# EAGLE design battery_sensor_connector (EAGLE 5.04)
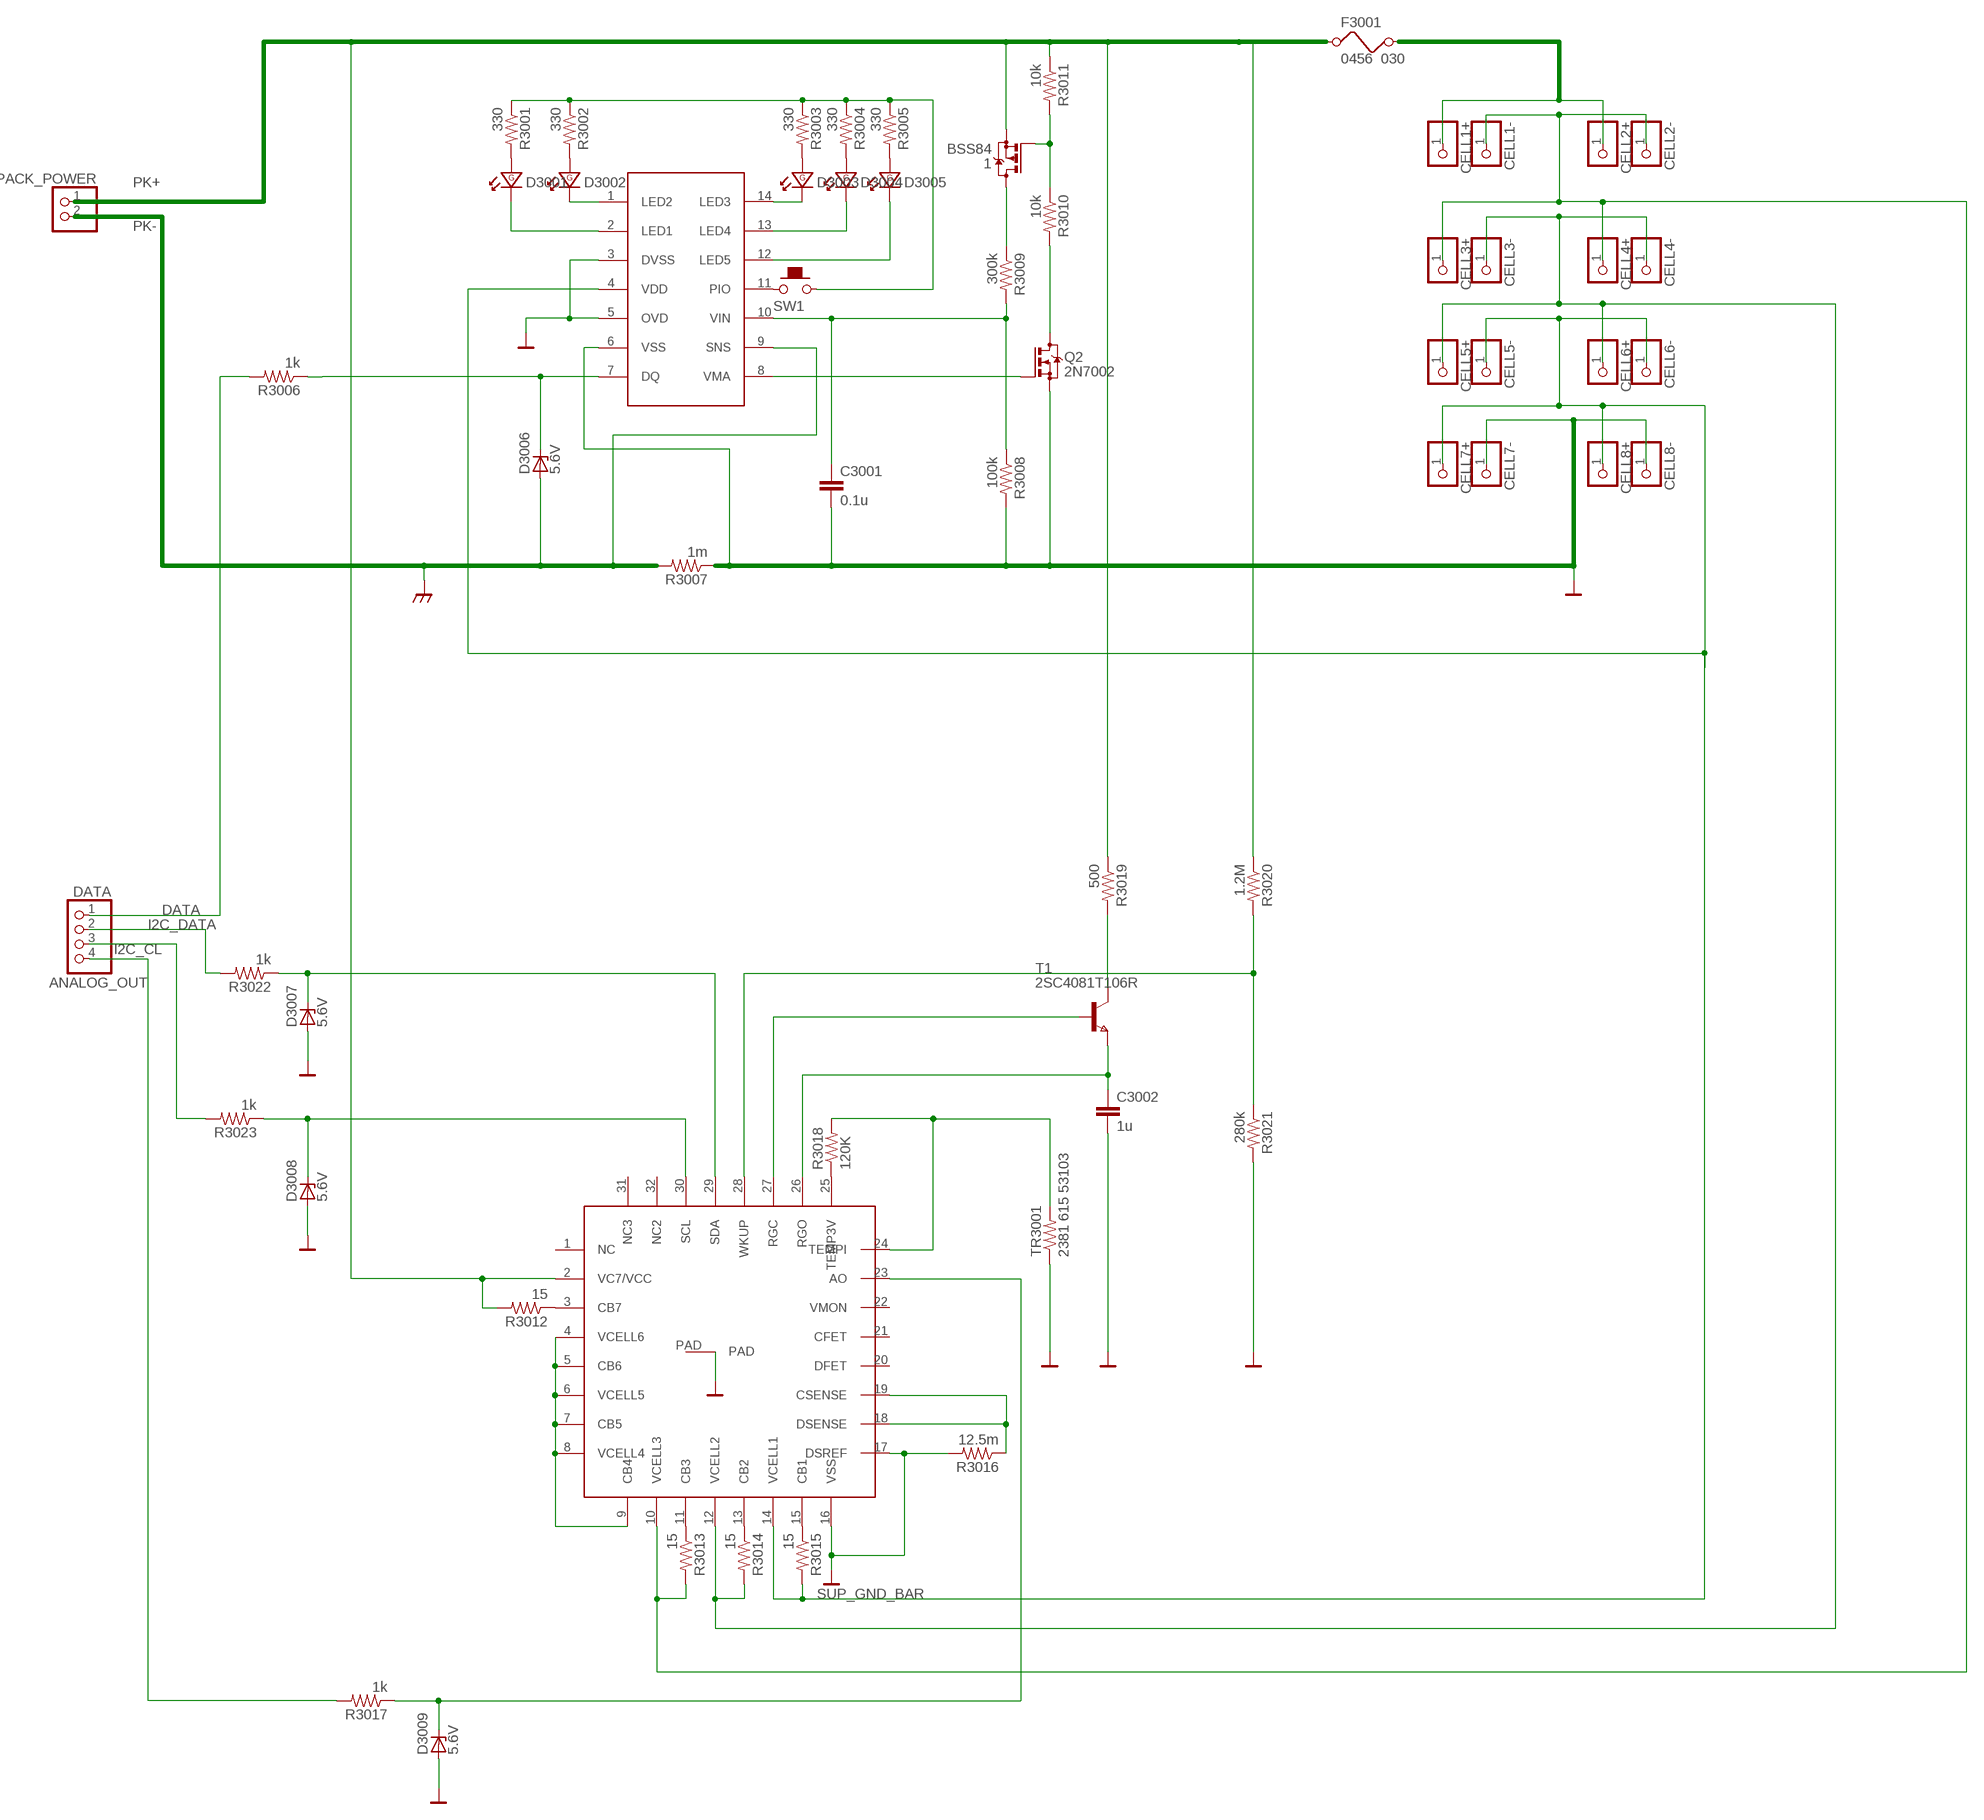
[diagram p0: schematic, sheet 1]

## Parts
1  BSS84  FET_P-CHNL  [SOT23-3]
C3001  0.1u  C-EUC0805  [C0805]
C3002  1u  C-EUC0805  [C0805]
CELL1+  PINHD-1X1  [1X01]
CELL1-  PINHD-1X1  [1X01]
CELL2+  PINHD-1X1  [1X01]
CELL2-  PINHD-1X1  [1X01]
CELL3+  PINHD-1X1  [1X01]
CELL3-  PINHD-1X1  [1X01]
CELL4+  PINHD-1X1  [1X01]
CELL4-  PINHD-1X1  [1X01]
CELL5+  PINHD-1X1  [1X01]
CELL5-  PINHD-1X1  [1X01]
CELL6+  PINHD-1X1  [1X01]
CELL6-  PINHD-1X1  [1X01]
CELL7+  PINHD-1X1  [1X01]
CELL7-  PINHD-1X1  [1X01]
CELL8+  PINHD-1X1  [1X01]
CELL8-  PINHD-1X1  [1X01]
D3001  LED-GRN-0805  [0805-DIODE]
D3002  LED-GRN-0805  [0805-DIODE]
D3003  LED-GRN-0805  [0805-DIODE]
D3004  LED-GRN-0805  [0805-DIODE]
D3005  LED-GRN-0805  [0805-DIODE]
D3006  5.6V  BZX84CSMD  [TO236]
D3007  5.6V  BZX84CSMD  [TO236]
D3008  5.6V  BZX84CSMD  [TO236]
D3009  5.6V  BZX84CSMD  [TO236]
DATA  PINHD-1X4  [1X04]
F3001  0456 030  FUSE1206  [1206]
PACK_POWER  PINHD-1X2  [1X02]
Q2  2N7002  FET_N-CHNLSOT223  [SOT223]
R3001  330  R-US_R0805  [R0805]
R3002  330  R-US_R0805  [R0805]
R3003  330  R-US_R0805  [R0805]
R3004  330  R-US_R0805  [R0805]
R3005  330  R-US_R0805  [R0805]
R3006  1k  R-US_R0805  [R0805]
R3007  1m  R-US_R0805  [R0805]
R3008  100k  R-US_R0805  [R0805]
R3009  300k  R-US_R0805  [R0805]
R3010  10k  R-US_R0805  [R0805]
R3011  10k  R-US_R0805  [R0805]
R3012  15  R-US_R0805  [R0805]
R3013  15  R-US_R0805  [R0805]
R3014  15  R-US_R0805  [R0805]
R3015  15  R-US_R0805  [R0805]
R3016  12.5m  R-US_R0805  [R0805]
R3017  1k  R-US_R0805  [R0805]
R3018  120K  R-US_R0805  [R0805]
R3019  500  R-US_R0805  [R0805]
R3020  1.2M  R-US_R0805  [R0805]
R3021  280k  R-US_R0805  [R0805]
R3022  1k  R-US_R0805  [R0805]
R3023  1k  R-US_R0805  [R0805]
SW1  SW_MOMENTARY-6X3.5MM  [SW_6X3.5MM]
T1  2SC4081T106R  NPNSOT323  [SOT323]
TR3001  2381 615 53103  R-US_R0805  [R0805]
U1  DS2788  [TSSOP14]
U2  ISL9208IRZ  [QFN32-5X5]

## Nets
ANALOG_OUT: DATA.4 R3017.2
BAR_GND: C3001.2 C3002.2 CELL7-.1 CELL8-.1 D3007.A D3008.A D3009.A Q2.3(S) R3007.1 R3008.2 R3016.2 R3021.2 TR3001.1 U1.3(DVSS) U1.5(OVD) U1.6(VSS) U2.16(U:VSS) U2.17(U:DSREF) ; supply symbol labelled SUP_GND_BAR
CELL4: CELL5-.1 CELL6-.1 CELL7+.1 CELL8+.1 R3015.2 U1.4(VDD) U2.14(U:VCELL1)
CELL_VOLTAGE: D3009.C R3017.1 U2.23(U:AO)
DATA: DATA.1 R3006.2
I2C_CL: D3008.C DATA.3 R3023.1 R3023.2 U2.30(U:SCL)
I2C_DATA: D3007.C DATA.2 R3022.1 R3022.2 U2.29(U:SDA)
N30: CELL1-.1 CELL2-.1 CELL3+.1 CELL4+.1 R3013.2 U2.10(U:VCELL3)
N$1: D3001.1(ANODE)(ANODE) R3001.2
N$3: D3002.1(ANODE)(ANODE) R3002.2
N$4: R3015.1 U2.15(U:CB1)
N$5: D3003.1(ANODE)(ANODE) R3003.2
N$7: R3014.1 U2.13(U:CB2)
N$8: D3004.1(ANODE)(ANODE) R3004.2
N$9: D3005.1(ANODE)(ANODE) R3005.2
N$11: D3002.2(CATHODE)(CATHODE) U1.1(LED2)
N$12: D3001.2(CATHODE)(CATHODE) U1.2(LED1)
N$13: D3003.2(CATHODE)(CATHODE) U1.14(LED3)
N$14: D3004.2(CATHODE)(CATHODE) U1.13(LED4)
N$15: D3005.2(CATHODE)(CATHODE) U1.12(LED5)
N$16: R3001.1 R3002.1 R3003.1 R3004.1 R3005.1 SW1.2
N$17: D3006.C R3006.1 U1.7(DQ)
N$18: C3002.1 T1.3(E) U2.26(U:RGO)
N$19: R3020.2 R3021.1 U2.28(U:WKUP)
N$20: C3001.1 R3008.1 R3009.2 U1.10(VIN)
N$21: Q2.1(G) U1.8(VMA)
N$22: 1.3(D) R3009.1
N$26: R3013.1 U2.11(U:CB3)
N$27: R3012.1 U2.3(U:CB7)
N$28: 1.1(G) R3010.1 R3011.2
N$29: CELL1+.1 CELL2+.1 F3001.2
N$30: U2.4(U:VCELL6) U2.5(U:CB6) U2.6(U:VCELL5) U2.7(U:CB5) U2.8(U:VCELL4) U2.9(U:CB4)
N$32: R3018.1 U2.25(U:TEMP3V)
N$33: R3018.2 TR3001.2 U2.24(U:TEMPI)
N$34: CELL3-.1 CELL4-.1 CELL5+.1 CELL6+.1 R3014.2 U2.12(U:VCELL2)
N$36: T1.2(B) U2.27(U:RGC)
N$39: R3019.2 T1.1(C)
N$40: SW1.1 U1.11(PIO)
N$41: Q2.4(D) R3010.2
N$43: R3016.1 U2.18(U:DSENSE) U2.19(U:CSENSE)
PK+: 1.2(S) F3001.1 PACK_POWER.1 R3011.1 R3012.2 R3019.1 R3020.1 U2.2(U:VC7/VCC)
PK-: D3006.A PACK_POWER.2 R3007.2 U1.9(SNS)
Unconnected: U2.1(U:NC) U2.20(U:DFET) U2.21(U:CFET) U2.22(U:VMON) U2.31(U:NC3) U2.32(U:NC2) U2.PAD(PAD:PAD)

## Library data of the parts
1 = psas_eagle_library:FET_P-CHNL: Generic P-Channel MOSFET
C3001 C3002 = rcl:C-EU: CAPACITOR, European symbol
CELL1+ CELL1- CELL2+ CELL2- CELL3+ CELL3- CELL4+ CELL4- CELL5+ CELL5- CELL6+ CELL6- CELL7+ CELL7- CELL8+ CELL8- = pinhead:PINHD-1X1: PIN HEADER
D3001-D3005 = psas_eagle_library:LED-GRN-?
D3006-D3009 = diode:BZX84CSMD: Z DIODE
DATA = pinhead:PINHD-1X4: PIN HEADER
F3001 = psas_eagle_library:FUSE: Fuse
PACK_POWER = pinhead:PINHD-1X2: PIN HEADER
Q2 = psas_eagle_library:FET_N-CHNL: Generic N-Channel MOSFET
R3001-R3023 TR3001 = rcl:R-US_: RESISTOR, American symbol
SW1 = psas_eagle_library-1.9:SW_MOMENTARY: Momentary push button
T1 = zetex:NPNSOT323: NPN TRANSISTOR
U1 = DS2788:DS2788: MAXIM stand-alone Fuel-Gauge IC with LED Display Drivers Package: 14 TSSOP
U2 = ISL9208:ISL9208: ISL9208 with Li-Ion Battery Pack analog front end

## Board
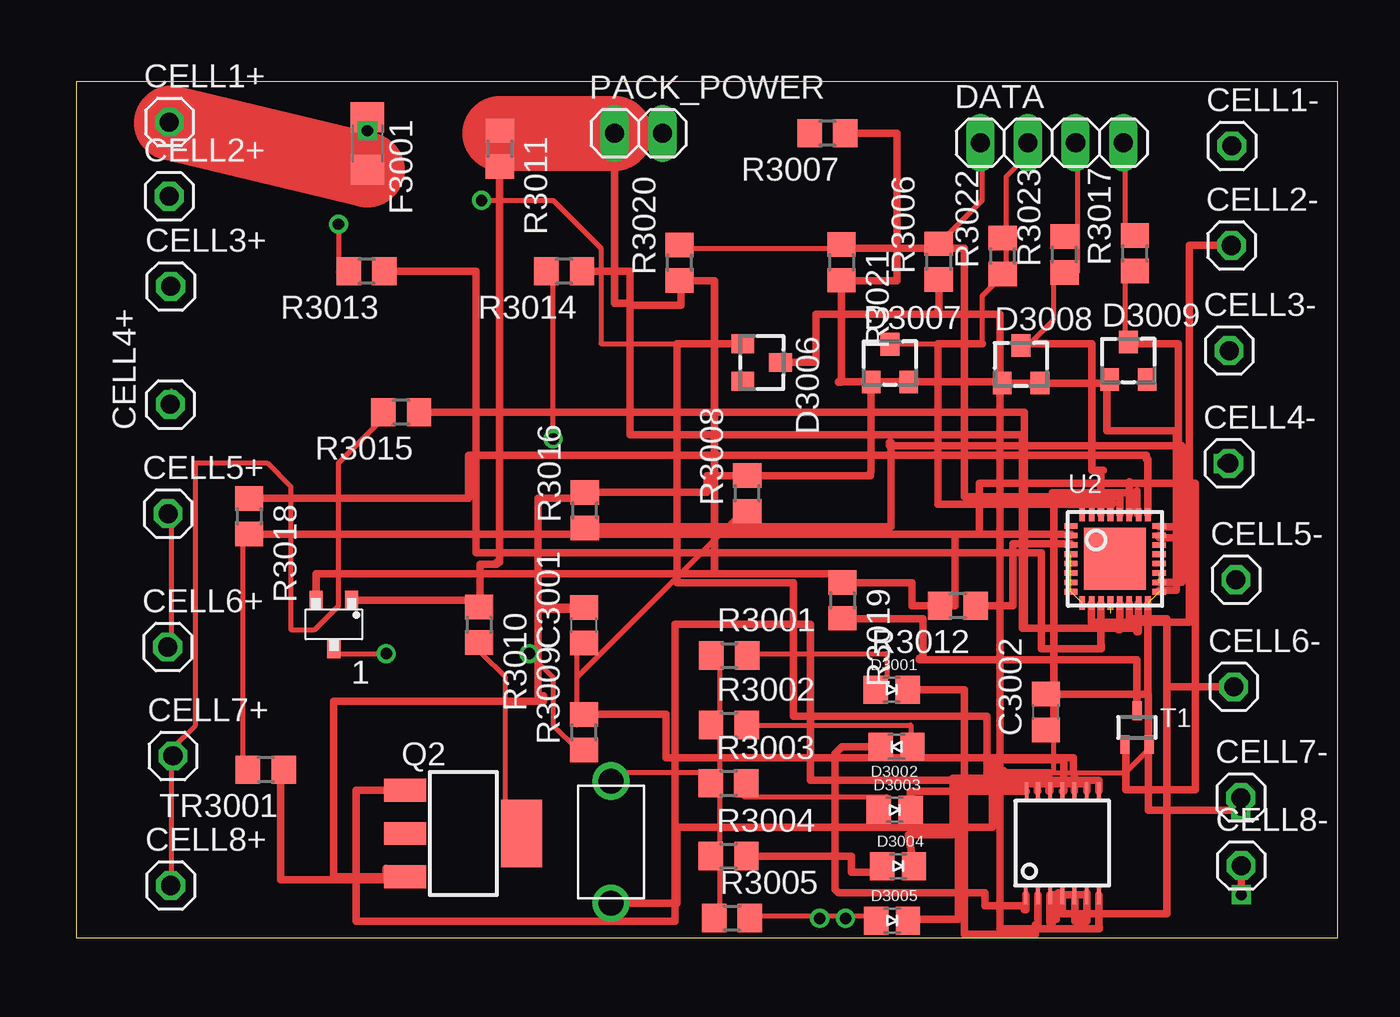
[diagram p1: board, top side]
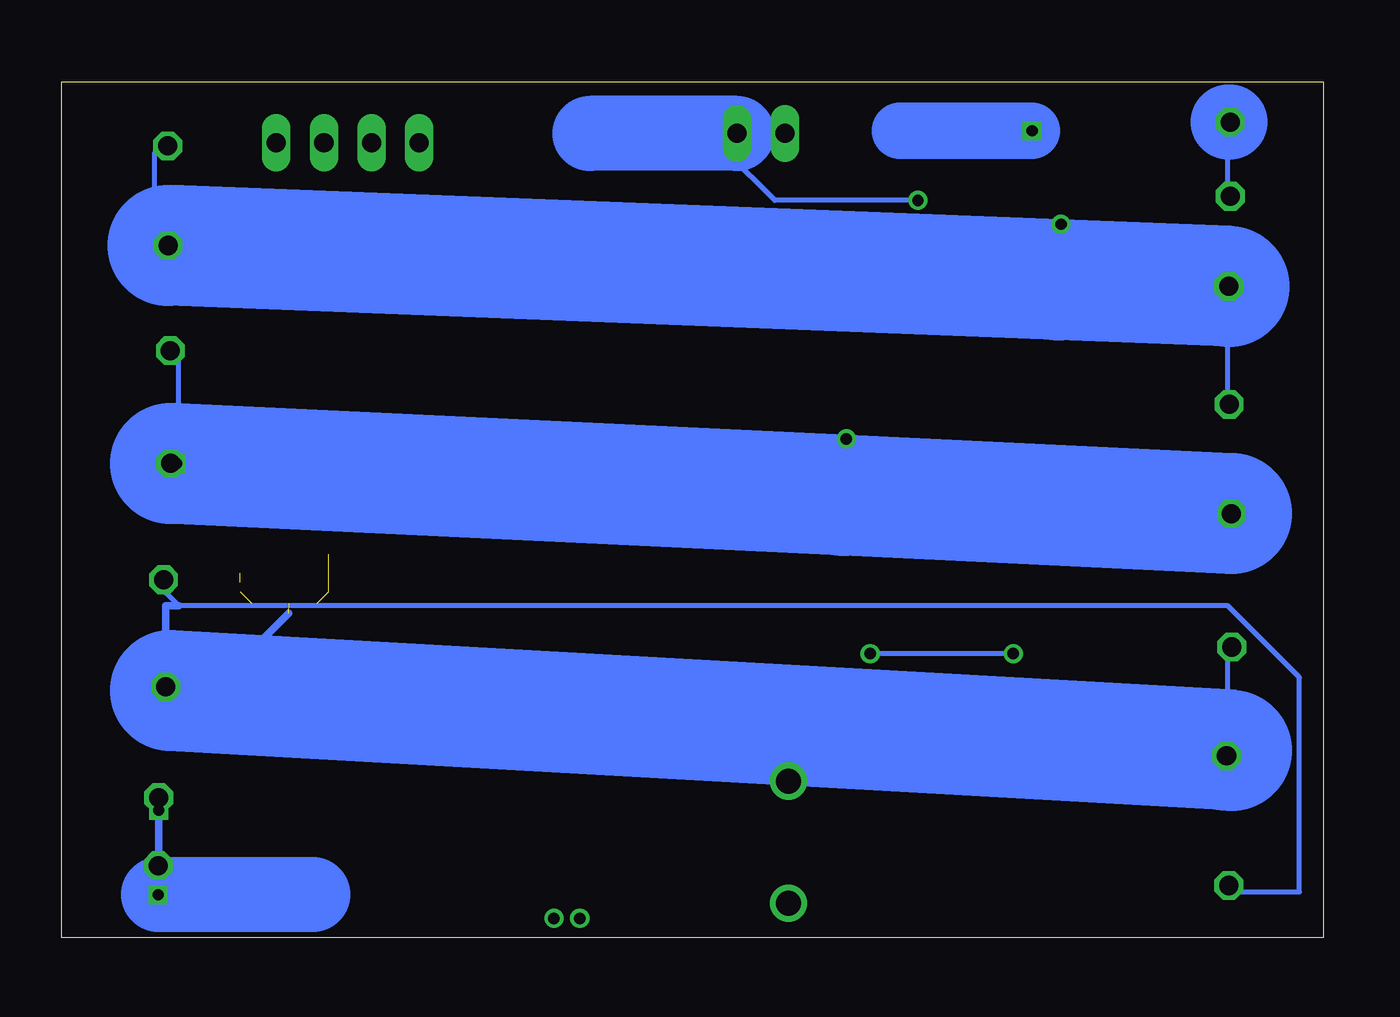
[diagram p2: board, bottom side, seen from below]

Size 67.2 x 45.6 mm. Coordinates in mm from the lower left corner, seen from the top.
Outline: 67.2,45.6 0,45.6 0,0 67.2,0 67.2,45.6
Copper layers (1*16): Top 0.035mm / dielectric 1.5mm / Bottom 0.035mm
Design rules "default": minimum track width 10mil, minimum drill 24mil, track to track 8mil, track to pad 8mil, pad to pad 8mil, via to via 8mil, smd to smd 8mil, copper to edge 40mil, drill to drill 8mil, minimum pad ring 10mil, minimum via ring 8mil, stop-mask expansion 4mil, vias tented up to drill 0mil, thermal gap 10mil

### Footprints (pad centres in the part's own frame; a part is rotated, then mirrored left to right if it is on the bottom)
SOT23-3 = smd 0.7 x 1: 1 -0.95,-1.3; 2 0.95,-1.3; 3 0,1.3
C0805 = smd 1.3 x 1.5: 1 -0.95,0; 2 0.95,0
1X01 = drill 1.016 octagon: 1 0,0
0805-DIODE = smd 1.3 x 1.5: 1(ANODE) -0.85,0; 2(CATHODE) 0.85,0
TO236 = smd 1 x 1.2: A -1,-1; C 0,1; NC 1,-1
1X04 = drill 1.016 long: 1 -3.81,0; 2 -1.27,0; 3 1.27,0; 4 3.81,0
1206 = smd 1.6 x 1.8: 1 -1.4,0; 2 1.4,0
1X02 = drill 1.016 long: 1 -1.27,0; 2 1.27,0
SOT223 = smd 1.219 x 2.235: 1 -2.311,-3.099; 2 0,-3.099; 3 2.311,-3.099 | smd 3.6 x 2.2: 4 0,3.099
R0805 = smd 1.3 x 1.5: 1 -0.95,0; 2 0.95,0
SW_6X3.5MM = drill 1.321 round: 1 -3.25,0; 2 3.25,0
SOT323 = smd 0.5 x 1: 1 0,0.9; 2 -0.65,-0.9; 3 0.65,-0.9
TSSOP14 = smd 0.2 x 1: 1 -1.95,-2.75; 2 -1.3,-2.75; 3 -0.65,-2.75; 4 0,-2.75; 5 0.65,-2.75; 6 1.3,-2.75; 7 1.95,-2.75; 8 1.95,2.75; 9 1.3,2.75; 10 0.65,2.75; 11 0,2.75; 12 -0.65,2.75; 13 -1.3,2.75; 14 -1.9,2.75
QFN32-5X5 = smd 0.7 x 0.3: 1 -2.35,1.75; 2 -2.35,1.25; 3 -2.35,0.75; 4 -2.35,0.25; 5 -2.35,-0.25; 6 -2.35,-0.75; 7 -2.35,-1.25; 8 -2.35,-1.75; 17 2.35,-1.75; 18 2.35,-1.25; 19 2.35,-0.75; 20 2.35,-0.25; 21 2.35,0.25; 22 2.35,0.75; 23 2.35,1.25; 24 2.35,1.75 | smd 0.3 x 0.7: 9 -1.75,-2.35; 10 -1.25,-2.35; 11 -0.75,-2.35; 12 -0.25,-2.35; 13 0.25,-2.35; 14 0.75,-2.35; 15 1.25,-2.35; 16 1.75,-2.35; 25 1.75,2.35; 26 1.25,2.35; 27 0.75,2.35; 28 0.25,2.35; 29 -0.25,2.35; 30 -0.75,2.35; 31 -1.25,2.35; 32 -1.75,2.35 | smd 3.3 x 3.3: PAD 0,0

### Placement (x,y rotation side)
1  13.72,16.69 180 top
C3001  27.04,16.65 90 top
C3002  51.64,12.03 90 top
CELL1+  4.96,43.44 0 top
CELL1-  61.55,42.17 0 top
CELL2+  4.95,39.49 0 top
CELL2-  61.53,36.87 0 top
CELL3+  5.03,34.69 0 top
CELL3-  61.41,31.27 0 top
CELL4+  5.01,28.41 90 top
CELL4-  61.39,25.27 0 top
CELL5+  4.89,22.59 0 top
CELL5-  61.77,19.07 0 top
CELL6+  4.87,15.49 0 top
CELL6-  61.65,13.37 0 top
CELL7+  5.15,9.69 0 top
CELL7-  62.03,7.47 0 top
CELL8+  5.03,2.79 0 top
CELL8-  62.05,3.85 0 top
D3001  43.43,13.22 0 top
D3002  43.69,10.18 180 top
D3003  43.59,6.82 0 top
D3004  43.77,3.82 0 top
D3005  43.45,0.92 0 top
D3006  36.51,30.64 270 top
D3007  43.34,30.61 0 top
D3008  50.32,30.54 0 top
D3009  56.04,30.74 0 top
DATA  51.96,42.34 0 top
F3001  15.51,42.3 270 top
PACK_POWER  29.95,42.84 0 top
Q2  20.62,5.56 270 top
R3001  34.78,15.04 0 top
R3002  34.76,11.34 0 top
R3003  34.74,8.24 0 top
R3004  34.75,4.36 0 top
R3005  34.93,1.06 0 top
R3006  45.94,36.01 90 top
R3007  40.01,42.84 180 top
R3008  35.74,23.67 90 top
R3009  27.04,10.95 90 top
R3010  21.46,16.67 270 top
R3011  22.56,42.03 270 top
R3012  46.95,17.69 180 top
R3013  15.47,35.49 180 top
R3014  25.99,35.49 180 top
R3015  17.31,27.99 180 top
R3016  27.09,22.77 90 top
R3017  56.39,36.46 90 top
R3018  9.21,22.45 270 top
R3019  40.81,17.97 270 top
R3020  32.14,35.95 90 top
R3021  40.76,35.97 270 top
R3022  49.34,36.31 90 top
R3023  52.64,36.39 90 top
SW1  28.48,5.1 90 top
T1  56.5,11.2 0 top
TR3001  10.1,8.96 180 top
U1  52.52,5.05 0 top
U2  55.33,20.18 0 top

### Tracks (layer width: path | path; a pad name or v marks a point on that pad's centre or on a via)
ANALOG_OUT
  Top 0.254: R3017.2 55.88,38 55.88,41.81 DATA.4
BAR_GND  (via drill 0.6)  (1 unrouted)
  Top 0.254: 16.51,3.71 Q2.3
  Top 0.406: R3007.1 43.7,42.84 43.7,35 40.76,35 R3021.2 40.76,29.6 40.6,29.6 40.6,29.61 D3007.A | 16.51,3.71 16.51,3.1 10.9,3.1 10.9,8.96 TR3001.1 | Q2.3 13.7,3.25 13.7,12.6 24.9,12.6 24.9,12.9 24.6,12.9 24.6,17.5 27.04,17.5 C3001.2 24.6,17.6 24.6,23.4 27.09,23.4 R3016.2 33.6,23.72 33.6,24.6 35.74,24.6 R3008.2 42.3,24.62 42.3,24.8 42.34,24.8 D3007.A | D3007.A 49.32,29.61 D3008.A 55.04,29.54 D3009.A 54.9,29.74 54.9,27 58.6,27 58.6,18.5 57.68,18.5 U2.17 | 52.3,2.4 52.3,2.3 | U1.6 53.82,2.4 | 57.08,12.98 C3002.2 | 57.08,12.98 U2.16 | 57.08,12.98 57.1,12.98 57.1,6.8 v62.03,6.8 CELL7-.1 | v62.05,2.3 CELL8-.1 | U1.5 U1.6 | U1.5 52.3,2.3 | 52.3,2.3 U1.3 51.87,0.8 52,0.8 52,1 52.2,1 52.2,2.3 52.3,2.3 | U1.5 U1.6 | U1.6 53.82,0.9 53.2,0.9 53.2,2.3 U1.5
  Bottom 0.406: v62.03,6.8 62.03,3.85 CELL8-.1
  Bottom 4: U1.6 v62.05,2.3
CELL4
  Top 0.254: 5.08,10.06 6.35,11.33 6.35,25.3 10.16,25.3 11.43,24.03 11.43,16.41 12.7,16.41 13.97,17.68 13.97,25.3 16.51,27.84 R3015.2 | 5.08,10.06 5.08,2.44 CELL8+.1 | 5.08,10.06 CELL7+.1
  Top 0.406: CELL6-.1 58.1,13.37 | 58.1,13.37 58.1,17 56.1,17 56.1,16.9 56.08,16.9 U2.14 | 58.1,13.37 58.1,1.3 52.5,1.3 52.5,1.5 52.52,1.5 U1.4
  Bottom 0.254: CELL5-.1 62.23,18.95 60.96,17.68 5.08,17.68 1.27,13.87 1.27,2.44 5.08,2.44 CELL8+.1
  Bottom 0.406: 60.96,17.68 61.65,17.68 CELL6-.1
CELL_VOLTAGE
  Top 0.254: D3009.C 55.88,31.65 55.88,35.46 R3017.1
  Top 0.406: 55.88,31.65 58.7,31.65 58.7,21.3 57.68,21.3 U2.23
DATA
  Top 0.254: R3006.2 45.72,36.73 48.26,39.27 48.26,41.81 DATA.1
I2C_CL
  Top 0.254: D3008.C 50.8,31.65 52.07,32.92 52.07,35.46 R3023.1 53.34,35.46 53.34,36.73 | 53.34,36.73 53.34,41.81 DATA.3 | 53.34,36.73 R3023.2
  Top 0.406: 50.8,31.65 54.1,31.65 54.1,24.9 54.58,24.9 | 54.7,24.9 54.58,24.9 | 54.58,24.9 U2.30
I2C_DATA
  Top 0.254: 49.53,35.46 48.26,34.19 48.26,31.65 43.18,31.65 D3007.C | 49.53,35.46 49.53,36.73 | 49.53,35.46 R3022.1 | 49.53,36.73 49.53,40.54 50.8,41.81 DATA.2 | 49.53,36.73 R3022.2
  Top 0.406: 48.26,31.65 45.9,31.65 45.9,23.1 55.2,23.1 55.2,23.2 55.08,23.2 U2.29
N30  (via drill 0.61)
  Top 0.254: CELL4+.1 5.08,29.11 | v13.97,38 13.97,35.46 R3013.2
  Top 0.406: CELL2-.1 59.3,36.87 59.3,16.8 54.08,16.8 U2.10
  Bottom 0.254: CELL3+.1 5.08,31.65 5.08,29.11 CELL4+.1 | 14.08,35.04 v13.97,38 | CELL1-.1 62.23,41.81 62.23,39.27 CELL2-.1
  Bottom 6.452: CELL3+.1 14.08,35.04 CELL2-.1
N$1
  Top 0.254: R3001.2 35.56,15.14 43.18,15.14 43.18,13.87 D3001.1(ANODE)
N$3
  Top 0.254: R3002.2 35.56,11.33 44.45,11.33 44.45,10.06 D3002.1(ANODE)
N$4
  Top 0.406: R3015.1 50.5,27.99 50.5,16.5 56.5,16.5 56.5,16.3 56.58,16.3 U2.15
N$5
  Top 0.254: R3003.2 35.56,7.52 43.18,7.52 D3003.1(ANODE)
N$7
  Top 0.406: R3014.1 29.5,35.49 29.5,26.8 50.4,26.8 50.4,16.5 55.5,16.5 55.5,16.4 55.58,16.4 U2.13
N$8
  Top 0.406: R3004.2 41.3,4.36 41.3,3.5 42.92,3.5 D3004.1(ANODE)
N$9  (via drill 0.61)
  Top 0.254: 39.37,1.17 40.64,1.17 | 40.64,1.17 43.18,1.17 D3005.1(ANODE) | 40.64,1.17 v40.98,1.04 | 39.37,1.17 35.56,1.17 R3005.2 | 39.37,1.17 v39.6,1.04
N$11
  Top 0.406: D3002.2(CATHODE) 40.78,10.18 40.4,9.8 40.4,2.6 40.6,2.4 48.4,2.4 48.4,1.7 50.5,1.7 50.5,1.5 50.57,1.5 U1.1
N$12
  Top 0.406: D3001.2(CATHODE) 47.3,13.22 47.3,0.2 51.1,0.2 51.1,0.7 51.22,0.7 U1.2
N$13
  Top 0.406: D3003.2(CATHODE) 44.44,7.8 U1.14
N$14
  Top 0.406: D3004.2(CATHODE) 44.32,5.5 46.7,5.5 46.7,8.5 51.2,8.5 51.2,7.8 U1.13
N$15
  Top 0.406: D3005.2(CATHODE) 44.3,1 47,1 47,8.2 | 47,8.2 47.6,8.2 47.6,8.1 47.2,8.1 | 48.7,8.9 49.4,8.9 49.4,8.8 51.8,8.8 51.8,7.8 U1.12 51.87,8.2 | 51.87,8.2 52,8.2 | 47,8.2 51.87,8.2
N$16
  Top 0.254: 34.29,8.79 34.29,11.33 | 34.29,11.33 34.29,15.14 R3001.1 | 34.29,11.33 R3002.1 | R3005.1 34.29,1.17 34.29,3.71 R3004.1 34.29,4.98 34.29,7.52 R3003.1 34.29,8.79 | 34.29,8.79 29.21,8.79 SW1.2
N$17
  Top 0.406: D3006.C 39.4,30.64 39.4,33.2 45.9,33.2 | 45.9,33.2 45.9,33.5 45.94,33.5 R3006.1 | 45.9,33.2 49.2,33.2 49.2,0.5 54.5,0.5 54.5,0.6 54.47,0.6 U1.7
N$18
  Top 0.254: T1.3 57.15,10.06 55.88,8.79 52.07,8.79 52.07,11.33 C3002.1
  Top 0.406: 52.07,11.33 52.07,23.63 52,23.7 56.4,23.7 56.5,23.8 56.5,22.61 U2.26
N$19
  Top 0.254: R3020.2 31.75,36.73 40.64,36.73 R3021.1
  Top 0.406: 40.64,36.73 47.3,36.73 47.3,23.5 55.5,23.5 55.5,23.7 55.58,23.7 U2.28
N$20
  Top 0.254: 26.67,13.87 26.67,15.14 C3001.1 | 26.67,13.87 26.67,11.33 R3009.2 | 26.67,13.87 35.56,22.76 R3008.1
  Top 0.406: R3009.2 31.4,11.9 31.4,9.6 53.1,9.6 53.1,8.8 53.17,8.8 U1.10
N$21
  Top 0.406: Q2.1 14.9,7.87 14.9,0.9 31.9,0.9 31.9,16.7 39.1,16.7 39.1,8.4 54.47,8.4 U1.8
N$22  (via drill 0.61)
  Top 0.254: v16.51,15.14 13.97,15.14 1.3 | v24.13,15.14 25.4,13.87 25.4,11.33 26.67,10.06 R3009.1
  Bottom 0.254: v16.51,15.14 v24.13,15.14
N$26
  Top 0.406: R3013.1 21.3,35.49 21.3,20.5 51.4,20.5 51.4,15.4 54.6,15.4 54.6,15.6 54.58,15.6 U2.11
N$27
  Top 0.406: R3012.1 49.9,17.69 49.9,21 52.98,21 U2.3
N$28
  Top 0.406: R3011.2 22.56,20 22.4,20 22.4,19.9 21.5,19.9 21.5,17.62 R3010.1 21.46,17.99 1.1
N$29  (via drill 0.6)
  Top 0.406: v5.08,43.44 5.08,43.4
  Top 4: 5.08,43.4 F3001.2
  Bottom 0.254: CELL2+.1 5.08,39.27 v5.08,43.44
  Bottom 4: v5.08,43.44 CELL1+.1
N$30  (5 unrouted)
N$32
  Top 0.406: R3018.1 20.9,23.4 20.9,25.7 57,25.7 57,25.5 57.08,25.5 U2.25
N$33
  Top 0.254: TR3001.2 8.89,8.79 8.89,21.49 R3018.2
  Top 0.406: R3018.2 48.1,21.5 48.1,24.2 59.4,24.2 59.4,21.9 57.68,21.9 U2.24
N$34  (via drill 0.6, 0.61)  (1 unrouted)
  Top 0.254: v25.4,26.57 25.4,35.46 R3014.2 | CELL6+.1 5.08,15.14 5.08,22.76 CELL5+.1
  Bottom 0.254: 4.97,22.59 5.08,20.22 | CELL6+.1 5.08,15.14 5.08,12.6 5.23,10.01 | 25.54,23.57 v25.4,26.57 | CELL3-.1 60.96,31.65 60.96,27.84 v61.08,25.25
  Bottom 0.406: 61.39,13.17 59.23,13.17 55.1,17.3
  Bottom 6.452: CELL5+.1 4.97,22.59 25.54,23.57 v61.08,25.25 CELL4-.1 | 4.89,9.99 5.23,10.01 61.39,13.17
N$36
  Top 0.406: T1.2 55.9,10.3 55.9,7.9 59.6,7.9 59.6,24.2 56.1,24.2 56.1,24.3 56.08,24.3 U2.27
N$39
  Top 0.406: T1.1 56.5,14.8 44.9,14.8 44.9,14.9 45.1,14.9 45.1,17 40.81,17 R3019.2
N$40
  Top 0.406: SW1.1 32,1.85 32,5.9 48.8,5.9 48.8,9.5 52.6,9.5 | 52.6,9.5 52.6,9.6 | U1.11 52.6,7.8 52.6,9.5
  Bottom 0.406: SW1.1 28.48,1.9
N$41
  Top 0.254: R3010.2 21.59,15.14 22.86,13.87 22.86,6.25 Q2.4
N$43  (1 unrouted)
  Top 0.406: R3016.1 27.09,21.9 43.4,21.9 43.4,26.4 43.3,26.4 43.3,26.2 58.9,26.2 58.9,18.93 U2.18
PK+  (via drill 0.6)
  Top 0.406: 34,19.4 34,35 R3020.1 32.2,35 32.2,33.7 29.5,33.7 29.5,33.8 28.68,33.8 PACK_POWER.1 | 34,19.4 40.81,19.4 R3019.1 44.5,18.92 44.5,17.7 R3012.2 46.8,17.69 46.8,21.5 52.98,21.5 U2.2 | v15.51,42.98 F3001.1 | R3011.1 22.56,42.84 | 1.2 12.77,19.4 34,19.4
  Top 4: 22.56,42.84 PACK_POWER.1
  Bottom 3: v15.51,42.98 R3011.1
PK-  (via drill 0.61)
  Top 0.254: v21.59,39.27 25.4,39.27 27.94,36.73 27.94,31.65 35.56,31.65 D3006.A
  Top 0.406: 35.56,31.65 32,31.65 32,18.9 38.2,18.9 38.2,11.8 48.5,11.8 48.5,8.2 53.82,8.2 U1.9
  Bottom 0.254: v21.59,39.27 29.21,39.27 31.75,41.81 PACK_POWER.2
  Bottom 4: PACK_POWER.2 R3007.2